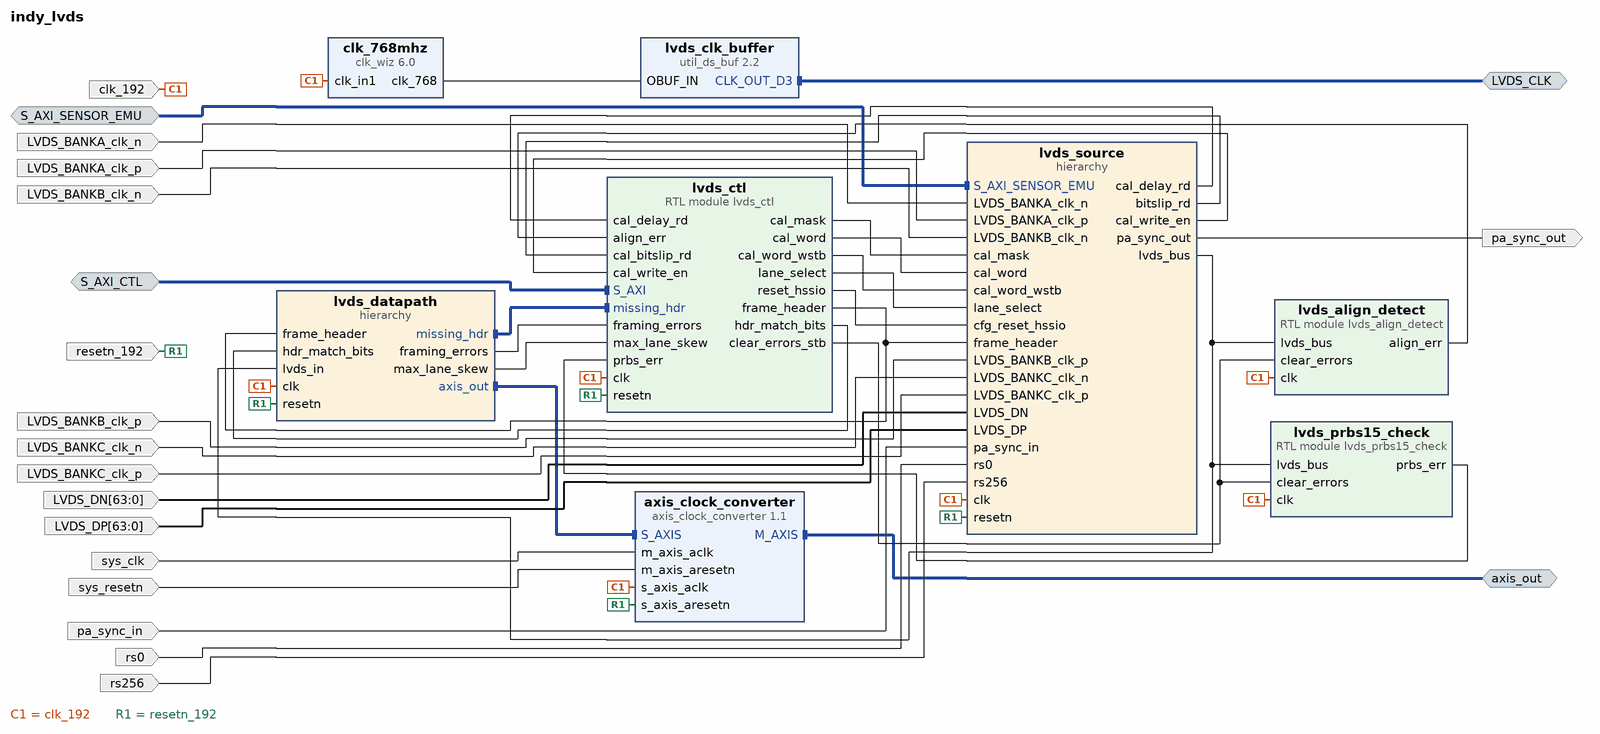
[diagram p0: block diagram of the top level]
# Vivado block design indy_lvds, xcku15p-ffve1517-3-e, Vivado 2024.2
create_bd_design indy_lvds

create_bd_intf_port -mode Slave -vlnv xilinx.com:interface:aximm_rtl:1.0 S_AXI_CTL
set_property -dict [list \
  CONFIG.ADDR_WIDTH 16 \
  CONFIG.ARUSER_WIDTH 0 \
  CONFIG.AWUSER_WIDTH 0 \
  CONFIG.BUSER_WIDTH 0 \
  CONFIG.CLK_DOMAIN top_level_clk_wiz_0_1_clk_192 \
  CONFIG.DATA_WIDTH 32 \
  CONFIG.FREQ_HZ 192000000 \
  CONFIG.HAS_BRESP 1 \
  CONFIG.HAS_BURST 0 \
  CONFIG.HAS_CACHE 0 \
  CONFIG.HAS_LOCK 0 \
  CONFIG.HAS_PROT 1 \
  CONFIG.HAS_QOS 0 \
  CONFIG.HAS_REGION 0 \
  CONFIG.HAS_RRESP 1 \
  CONFIG.HAS_WSTRB 1 \
  CONFIG.ID_WIDTH 0 \
  CONFIG.MAX_BURST_LENGTH 1 \
  CONFIG.NUM_READ_OUTSTANDING 1 \
  CONFIG.NUM_READ_THREADS 1 \
  CONFIG.NUM_WRITE_OUTSTANDING 1 \
  CONFIG.NUM_WRITE_THREADS 1 \
  CONFIG.PROTOCOL AXI4LITE \
  CONFIG.READ_WRITE_MODE READ_WRITE \
  CONFIG.RUSER_BITS_PER_BYTE 0 \
  CONFIG.RUSER_WIDTH 0 \
  CONFIG.SUPPORTS_NARROW_BURST 0 \
  CONFIG.WUSER_BITS_PER_BYTE 0 \
  CONFIG.WUSER_WIDTH 0 \
] [get_bd_intf_ports S_AXI_CTL]
create_bd_intf_port -mode Master -vlnv xilinx.com:interface:diff_clock_rtl:1.0 LVDS_CLK
create_bd_intf_port -mode Slave -vlnv xilinx.com:interface:aximm_rtl:1.0 S_AXI_SENSOR_EMU
set_property -dict [list \
  CONFIG.ADDR_WIDTH 32 \
  CONFIG.ARUSER_WIDTH 0 \
  CONFIG.AWUSER_WIDTH 0 \
  CONFIG.BUSER_WIDTH 0 \
  CONFIG.CLK_DOMAIN top_level_clk_wiz_0_1_clk_192 \
  CONFIG.DATA_WIDTH 32 \
  CONFIG.FREQ_HZ 192000000 \
  CONFIG.HAS_BRESP 1 \
  CONFIG.HAS_BURST 0 \
  CONFIG.HAS_CACHE 0 \
  CONFIG.HAS_LOCK 0 \
  CONFIG.HAS_PROT 1 \
  CONFIG.HAS_QOS 0 \
  CONFIG.HAS_REGION 0 \
  CONFIG.HAS_RRESP 1 \
  CONFIG.HAS_WSTRB 1 \
  CONFIG.ID_WIDTH 0 \
  CONFIG.NUM_READ_OUTSTANDING 1 \
  CONFIG.NUM_READ_THREADS 1 \
  CONFIG.NUM_WRITE_OUTSTANDING 1 \
  CONFIG.NUM_WRITE_THREADS 1 \
  CONFIG.PROTOCOL AXI4LITE \
  CONFIG.READ_WRITE_MODE READ_WRITE \
  CONFIG.RUSER_BITS_PER_BYTE 0 \
  CONFIG.RUSER_WIDTH 0 \
  CONFIG.WUSER_BITS_PER_BYTE 0 \
  CONFIG.WUSER_WIDTH 0 \
] [get_bd_intf_ports S_AXI_SENSOR_EMU]
create_bd_intf_port -mode Master -vlnv xilinx.com:interface:axis_rtl:1.0 axis_out
set_property -dict {CONFIG.FREQ_HZ 10000000} [get_bd_intf_ports axis_out]
create_bd_port -dir I LVDS_BANKA_clk_n
create_bd_port -dir I LVDS_BANKA_clk_p
create_bd_port -dir I LVDS_BANKB_clk_n
create_bd_port -dir I LVDS_BANKB_clk_p
create_bd_port -dir I LVDS_BANKC_clk_n
create_bd_port -dir I LVDS_BANKC_clk_p
create_bd_port -dir I -from 63 -to 0 LVDS_DN
create_bd_port -dir I -from 63 -to 0 LVDS_DP
create_bd_port -dir I -type clk clk_192
set_property -dict [list \
  CONFIG.ASSOCIATED_BUSIF S_AXI_CTL:S_AXI_SENSOR_EMU \
  CONFIG.ASSOCIATED_RESET resetn_192 \
  CONFIG.CLK_DOMAIN top_level_clk_wiz_0_1_clk_192 \
  CONFIG.FREQ_HZ 192000000 \
] [get_bd_ports clk_192]
create_bd_port -dir I -type rst resetn_192
create_bd_port -dir I rs0
create_bd_port -dir I rs256
create_bd_port -dir I pa_sync_in
create_bd_port -dir O pa_sync_out
create_bd_port -dir I -type rst sys_resetn
create_bd_port -dir I -type clk sys_clk
set_property -dict {CONFIG.ASSOCIATED_BUSIF axis_out CONFIG.FREQ_HZ 10000000} [get_bd_ports sys_clk]

create_bd_cell -type module -reference lvds_ctl lvds_ctl
create_bd_cell -type hier lvds_source
create_bd_cell -type ip -vlnv xilinx.com:ip:clk_wiz:6.0 clk_768mhz
set_property -dict [list \
  CONFIG.CLKOUT1_DRIVES No_buffer \
  CONFIG.CLKOUT1_JITTER 64.075 \
  CONFIG.CLKOUT1_PHASE_ERROR 72.940 \
  CONFIG.CLKOUT1_REQUESTED_OUT_FREQ 768 \
  CONFIG.CLK_OUT1_PORT clk_768 \
  CONFIG.FEEDBACK_SOURCE FDBK_ONCHIP \
  CONFIG.MMCM_CLKFBOUT_MULT_F 8.000 \
  CONFIG.MMCM_CLKOUT0_DIVIDE_F 2.000 \
  CONFIG.PRIM_SOURCE Global_buffer \
  CONFIG.USE_LOCKED false \
  CONFIG.USE_RESET false \
] [get_bd_cells clk_768mhz]
create_bd_cell -type ip -vlnv xilinx.com:ip:util_ds_buf:2.2 lvds_clk_buffer
set_property -dict {CONFIG.C_BUF_TYPE OBUFDS} [get_bd_cells lvds_clk_buffer]
create_bd_cell -type module -reference lvds_align_detect lvds_align_detect
create_bd_cell -type module -reference lvds_prbs15_check lvds_prbs15_check
create_bd_cell -type hier lvds_datapath
create_bd_cell -type ip -vlnv xilinx.com:ip:axis_clock_converter:1.1 axis_clock_converter

# ---- hierarchy /lvds_source ----
current_bd_instance /lvds_source
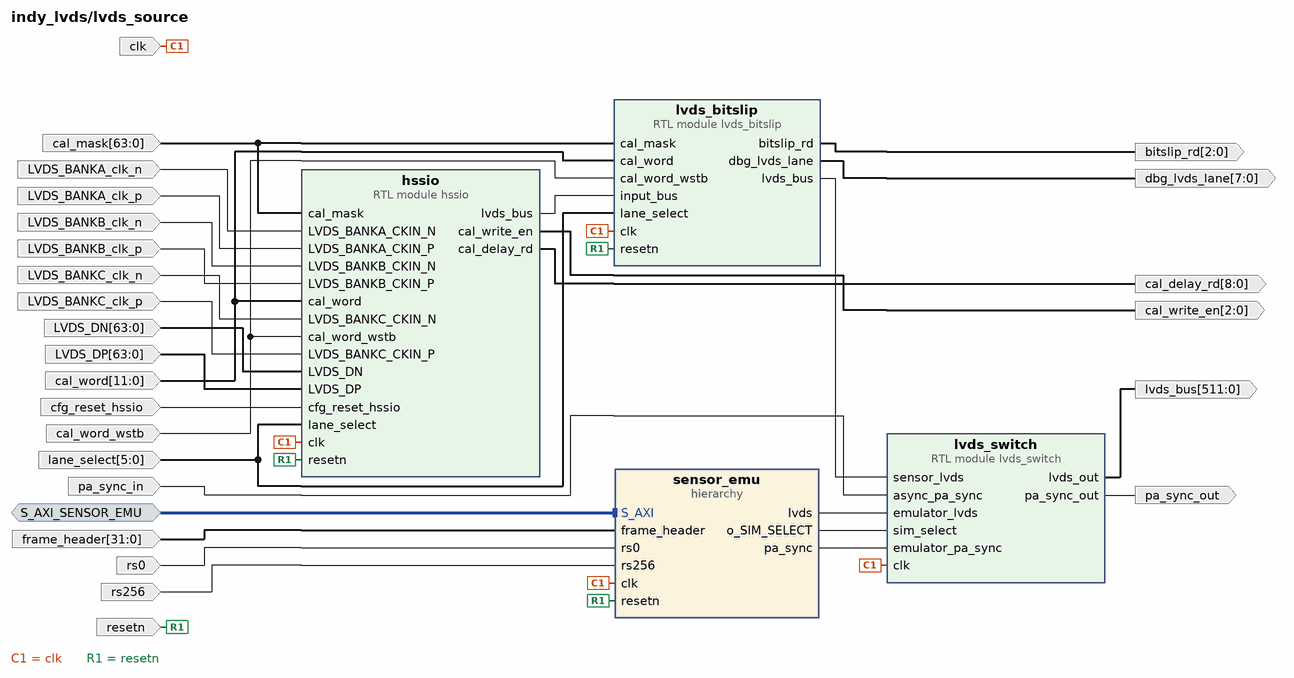
[diagram p1: block diagram inside /lvds_source]
create_bd_intf_pin -mode Slave -vlnv xilinx.com:interface:aximm_rtl:1.0 S_AXI_SENSOR_EMU
create_bd_pin -dir I -type clk clk
create_bd_pin -dir I -type rst resetn
create_bd_pin -dir I -from 5 -to 0 lane_select
create_bd_pin -dir I cal_word_wstb
create_bd_pin -dir I -from 11 -to 0 cal_word
create_bd_pin -dir I LVDS_BANKA_clk_p
create_bd_pin -dir I LVDS_BANKA_clk_n
create_bd_pin -dir I LVDS_BANKB_clk_p
create_bd_pin -dir I LVDS_BANKB_clk_n
create_bd_pin -dir I LVDS_BANKC_clk_p
create_bd_pin -dir I LVDS_BANKC_clk_n
create_bd_pin -dir I -from 63 -to 0 LVDS_DN
create_bd_pin -dir I -from 63 -to 0 LVDS_DP
create_bd_pin -dir I cfg_reset_hssio
create_bd_pin -dir O -from 8 -to 0 cal_delay_rd
create_bd_pin -dir O -from 2 -to 0 cal_write_en
create_bd_pin -dir I -from 63 -to 0 cal_mask
create_bd_pin -dir O -from 2 -to 0 bitslip_rd
create_bd_pin -dir O -from 511 -to 0 lvds_bus
create_bd_pin -dir O -from 7 -to 0 dbg_lvds_lane
create_bd_pin -dir I rs0
create_bd_pin -dir I rs256
create_bd_pin -dir I -from 31 -to 0 frame_header
create_bd_pin -dir I pa_sync_in
create_bd_pin -dir O pa_sync_out

create_bd_cell -type module -reference hssio hssio
create_bd_cell -type module -reference lvds_bitslip lvds_bitslip
create_bd_cell -type hier sensor_emu
create_bd_cell -type module -reference lvds_switch lvds_switch

# ---- hierarchy /lvds_source/sensor_emu ----
current_bd_instance /lvds_source/sensor_emu
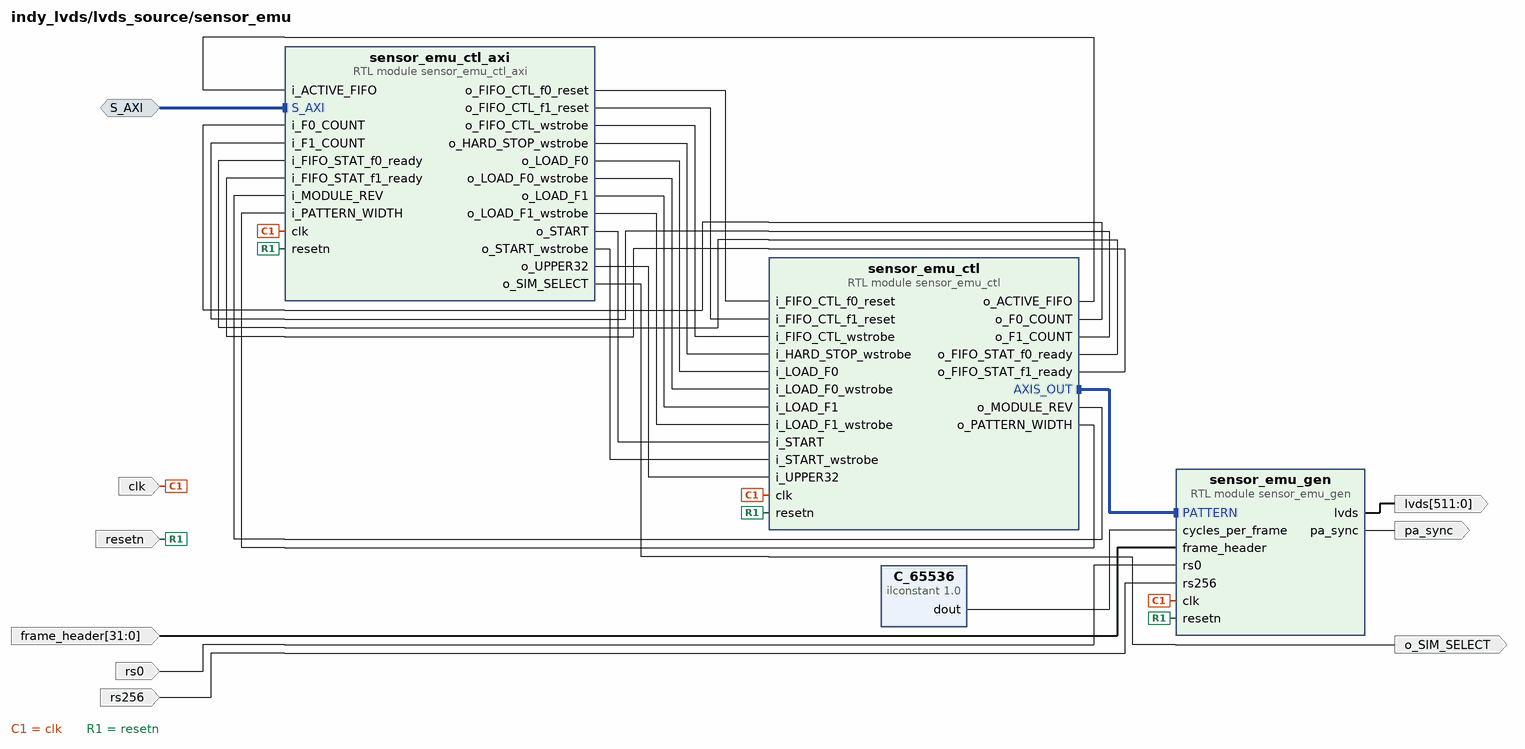
[diagram p2: block diagram inside /lvds_source/sensor_emu]
create_bd_intf_pin -mode Slave -vlnv xilinx.com:interface:aximm_rtl:1.0 S_AXI
create_bd_pin -dir I clk
create_bd_pin -dir I resetn
create_bd_pin -dir I rs0
create_bd_pin -dir I rs256
create_bd_pin -dir O -from 511 -to 0 lvds
create_bd_pin -dir O pa_sync
create_bd_pin -dir I -from 31 -to 0 frame_header
create_bd_pin -dir O o_SIM_SELECT

create_bd_cell -type module -reference sensor_emu_ctl sensor_emu_ctl
create_bd_cell -type module -reference sensor_emu_gen sensor_emu_gen
create_bd_cell -type module -reference sensor_emu_ctl_axi sensor_emu_ctl_axi
create_bd_cell -type inline_hdl -vlnv xilinx.com:inline_hdl:ilconstant:1.0 C_65536
set_property -dict {CONFIG.CONST_VAL 65536 CONFIG.CONST_WIDTH 32} [get_bd_cells C_65536]

# ---- hierarchy /lvds_datapath ----
current_bd_instance /lvds_datapath
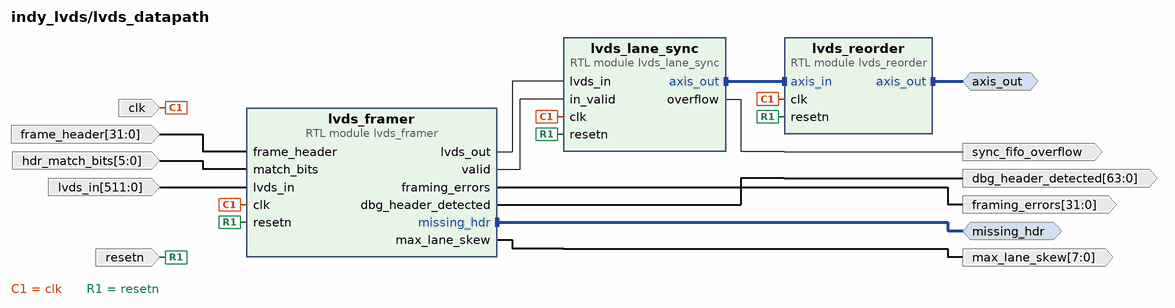
[diagram p3: block diagram inside /lvds_datapath]
create_bd_intf_pin -mode Master -vlnv xilinx.com:interface:axis_rtl:1.0 missing_hdr
create_bd_intf_pin -mode Master -vlnv xilinx.com:interface:axis_rtl:1.0 axis_out
create_bd_pin -dir I -type clk clk
create_bd_pin -dir I -type rst resetn
create_bd_pin -dir I -from 31 -to 0 frame_header
create_bd_pin -dir I -from 5 -to 0 hdr_match_bits
create_bd_pin -dir I -from 511 -to 0 lvds_in
create_bd_pin -dir O -from 31 -to 0 framing_errors
create_bd_pin -dir O -from 7 -to 0 max_lane_skew
create_bd_pin -dir O sync_fifo_overflow
create_bd_pin -dir O -from 63 -to 0 dbg_header_detected

create_bd_cell -type module -reference lvds_framer lvds_framer
create_bd_cell -type module -reference lvds_lane_sync lvds_lane_sync
create_bd_cell -type module -reference lvds_reorder lvds_reorder

# ---- connections ----

current_bd_instance /lvds_source
connect_bd_intf_net [get_bd_intf_pins S_AXI_SENSOR_EMU] [get_bd_intf_pins sensor_emu/S_AXI]
connect_bd_net [get_bd_pins LVDS_BANKA_clk_n] [get_bd_pins hssio/LVDS_BANKA_CKIN_N]
connect_bd_net [get_bd_pins LVDS_BANKA_clk_p] [get_bd_pins hssio/LVDS_BANKA_CKIN_P]
connect_bd_net [get_bd_pins LVDS_BANKB_clk_n] [get_bd_pins hssio/LVDS_BANKB_CKIN_N]
connect_bd_net [get_bd_pins LVDS_BANKB_clk_p] [get_bd_pins hssio/LVDS_BANKB_CKIN_P]
connect_bd_net [get_bd_pins LVDS_BANKC_clk_n] [get_bd_pins hssio/LVDS_BANKC_CKIN_N]
connect_bd_net [get_bd_pins LVDS_BANKC_clk_p] [get_bd_pins hssio/LVDS_BANKC_CKIN_P]
connect_bd_net [get_bd_pins LVDS_DN] [get_bd_pins hssio/LVDS_DN]
connect_bd_net [get_bd_pins LVDS_DP] [get_bd_pins hssio/LVDS_DP]
connect_bd_net [get_bd_pins cal_mask] [get_bd_pins hssio/cal_mask] [get_bd_pins lvds_bitslip/cal_mask]
connect_bd_net [get_bd_pins cal_word] [get_bd_pins hssio/cal_word] [get_bd_pins lvds_bitslip/cal_word]
connect_bd_net [get_bd_pins cal_word_wstb] [get_bd_pins hssio/cal_word_wstb] [get_bd_pins lvds_bitslip/cal_word_wstb]
connect_bd_net [get_bd_pins cfg_reset_hssio] [get_bd_pins hssio/cfg_reset_hssio]
connect_bd_net -net clk_192mhz_clk_192 [get_bd_pins clk] \
  [get_bd_pins hssio/clk] [get_bd_pins lvds_bitslip/clk] [get_bd_pins sensor_emu/clk] [get_bd_pins lvds_switch/clk]
connect_bd_net [get_bd_pins frame_header] [get_bd_pins sensor_emu/frame_header]
connect_bd_net [get_bd_pins hssio/cal_write_en] [get_bd_pins cal_write_en]
connect_bd_net -net hssio_delay_rd [get_bd_pins hssio/cal_delay_rd] [get_bd_pins cal_delay_rd]
connect_bd_net [get_bd_pins hssio/lvds_bus] [get_bd_pins lvds_bitslip/input_bus]
connect_bd_net [get_bd_pins lane_select] [get_bd_pins hssio/lane_select] [get_bd_pins lvds_bitslip/lane_select]
connect_bd_net [get_bd_pins lvds_bitslip/bitslip_rd] [get_bd_pins bitslip_rd]
connect_bd_net [get_bd_pins lvds_bitslip/dbg_lvds_lane] [get_bd_pins dbg_lvds_lane]
connect_bd_net [get_bd_pins lvds_bitslip/lvds_bus] [get_bd_pins lvds_switch/sensor_lvds]
connect_bd_net -net lvds_switch_0_lvds_out [get_bd_pins lvds_switch/lvds_out] [get_bd_pins lvds_bus]
connect_bd_net -net lvds_switch_0_pa_sync_out [get_bd_pins lvds_switch/pa_sync_out] [get_bd_pins pa_sync_out]
connect_bd_net [get_bd_pins pa_sync_in] [get_bd_pins lvds_switch/async_pa_sync]
connect_bd_net -net rs0_1 [get_bd_pins rs0] [get_bd_pins sensor_emu/rs0]
connect_bd_net -net rs256_1 [get_bd_pins rs256] [get_bd_pins sensor_emu/rs256]
connect_bd_net [get_bd_pins sensor_emu/lvds] [get_bd_pins lvds_switch/emulator_lvds]
connect_bd_net [get_bd_pins sensor_emu/o_SIM_SELECT] [get_bd_pins lvds_switch/sim_select]
connect_bd_net [get_bd_pins sensor_emu/pa_sync] [get_bd_pins lvds_switch/emulator_pa_sync]
connect_bd_net -net sys_192mhz_resetn_192 [get_bd_pins resetn] \
  [get_bd_pins hssio/resetn] [get_bd_pins lvds_bitslip/resetn] [get_bd_pins sensor_emu/resetn]

current_bd_instance /lvds_source/sensor_emu
connect_bd_intf_net [get_bd_intf_pins S_AXI] [get_bd_intf_pins sensor_emu_ctl_axi/S_AXI]
connect_bd_intf_net -intf_net sensor_emu_ctl_0_AXIS_OUT [get_bd_intf_pins sensor_emu_ctl/AXIS_OUT] [get_bd_intf_pins sensor_emu_gen/PATTERN]
connect_bd_net [get_bd_pins clk] [get_bd_pins sensor_emu_ctl/clk] [get_bd_pins sensor_emu_gen/clk] [get_bd_pins sensor_emu_ctl_axi/clk]
connect_bd_net [get_bd_pins frame_header] [get_bd_pins sensor_emu_gen/frame_header]
connect_bd_net -net ilconstant_0_dout [get_bd_pins C_65536/dout] [get_bd_pins sensor_emu_gen/cycles_per_frame]
connect_bd_net [get_bd_pins resetn] [get_bd_pins sensor_emu_ctl/resetn] [get_bd_pins sensor_emu_gen/resetn] [get_bd_pins sensor_emu_ctl_axi/resetn]
connect_bd_net -net rs0_1 [get_bd_pins rs0] [get_bd_pins sensor_emu_gen/rs0]
connect_bd_net -net rs256_1 [get_bd_pins rs256] [get_bd_pins sensor_emu_gen/rs256]
connect_bd_net -net sensor_emu_ctl_0_o_ACTIVE_FIFO [get_bd_pins sensor_emu_ctl/o_ACTIVE_FIFO] [get_bd_pins sensor_emu_ctl_axi/i_ACTIVE_FIFO]
connect_bd_net -net sensor_emu_ctl_0_o_F0_COUNT [get_bd_pins sensor_emu_ctl/o_F0_COUNT] [get_bd_pins sensor_emu_ctl_axi/i_F0_COUNT]
connect_bd_net -net sensor_emu_ctl_0_o_F1_COUNT [get_bd_pins sensor_emu_ctl/o_F1_COUNT] [get_bd_pins sensor_emu_ctl_axi/i_F1_COUNT]
connect_bd_net -net sensor_emu_ctl_0_o_FIFO_STAT_f0_ready [get_bd_pins sensor_emu_ctl/o_FIFO_STAT_f0_ready] \
  [get_bd_pins sensor_emu_ctl_axi/i_FIFO_STAT_f0_ready]
connect_bd_net -net sensor_emu_ctl_0_o_FIFO_STAT_f1_ready [get_bd_pins sensor_emu_ctl/o_FIFO_STAT_f1_ready] \
  [get_bd_pins sensor_emu_ctl_axi/i_FIFO_STAT_f1_ready]
connect_bd_net -net sensor_emu_ctl_0_o_MODULE_REV [get_bd_pins sensor_emu_ctl/o_MODULE_REV] [get_bd_pins sensor_emu_ctl_axi/i_MODULE_REV]
connect_bd_net -net sensor_emu_ctl_0_o_PATTERN_WIDTH [get_bd_pins sensor_emu_ctl/o_PATTERN_WIDTH] [get_bd_pins sensor_emu_ctl_axi/i_PATTERN_WIDTH]
connect_bd_net -net sensor_emu_ctl_axi_0_o_FIFO_CTL_f0_reset [get_bd_pins sensor_emu_ctl_axi/o_FIFO_CTL_f0_reset] \
  [get_bd_pins sensor_emu_ctl/i_FIFO_CTL_f0_reset]
connect_bd_net -net sensor_emu_ctl_axi_0_o_FIFO_CTL_f1_reset [get_bd_pins sensor_emu_ctl_axi/o_FIFO_CTL_f1_reset] \
  [get_bd_pins sensor_emu_ctl/i_FIFO_CTL_f1_reset]
connect_bd_net -net sensor_emu_ctl_axi_0_o_FIFO_CTL_wstrobe [get_bd_pins sensor_emu_ctl_axi/o_FIFO_CTL_wstrobe] \
  [get_bd_pins sensor_emu_ctl/i_FIFO_CTL_wstrobe]
connect_bd_net -net sensor_emu_ctl_axi_0_o_HARD_STOP_wstrobe [get_bd_pins sensor_emu_ctl_axi/o_HARD_STOP_wstrobe] \
  [get_bd_pins sensor_emu_ctl/i_HARD_STOP_wstrobe]
connect_bd_net -net sensor_emu_ctl_axi_0_o_LOAD_F0 [get_bd_pins sensor_emu_ctl_axi/o_LOAD_F0] [get_bd_pins sensor_emu_ctl/i_LOAD_F0]
connect_bd_net -net sensor_emu_ctl_axi_0_o_LOAD_F0_wstrobe [get_bd_pins sensor_emu_ctl_axi/o_LOAD_F0_wstrobe] \
  [get_bd_pins sensor_emu_ctl/i_LOAD_F0_wstrobe]
connect_bd_net -net sensor_emu_ctl_axi_0_o_LOAD_F1 [get_bd_pins sensor_emu_ctl_axi/o_LOAD_F1] [get_bd_pins sensor_emu_ctl/i_LOAD_F1]
connect_bd_net -net sensor_emu_ctl_axi_0_o_LOAD_F1_wstrobe [get_bd_pins sensor_emu_ctl_axi/o_LOAD_F1_wstrobe] \
  [get_bd_pins sensor_emu_ctl/i_LOAD_F1_wstrobe]
connect_bd_net -net sensor_emu_ctl_axi_0_o_SIM_SELECT [get_bd_pins sensor_emu_ctl_axi/o_SIM_SELECT] [get_bd_pins o_SIM_SELECT]
connect_bd_net -net sensor_emu_ctl_axi_0_o_START [get_bd_pins sensor_emu_ctl_axi/o_START] [get_bd_pins sensor_emu_ctl/i_START]
connect_bd_net -net sensor_emu_ctl_axi_0_o_START_wstrobe [get_bd_pins sensor_emu_ctl_axi/o_START_wstrobe] [get_bd_pins sensor_emu_ctl/i_START_wstrobe]
connect_bd_net -net sensor_emu_ctl_axi_0_o_UPPER32 [get_bd_pins sensor_emu_ctl_axi/o_UPPER32] [get_bd_pins sensor_emu_ctl/i_UPPER32]
connect_bd_net -net sensor_emu_gen_0_lvds [get_bd_pins sensor_emu_gen/lvds] [get_bd_pins lvds]
connect_bd_net -net sensor_emu_gen_0_pa_sync [get_bd_pins sensor_emu_gen/pa_sync] [get_bd_pins pa_sync]

current_bd_instance /lvds_datapath
connect_bd_intf_net [get_bd_intf_pins missing_hdr] [get_bd_intf_pins lvds_framer/missing_hdr]
connect_bd_intf_net [get_bd_intf_pins lvds_reorder/axis_in] [get_bd_intf_pins lvds_lane_sync/axis_out]
connect_bd_intf_net [get_bd_intf_pins axis_out] [get_bd_intf_pins lvds_reorder/axis_out]
connect_bd_net -net clk_192mhz_clk_192 [get_bd_pins clk] [get_bd_pins lvds_lane_sync/clk] [get_bd_pins lvds_framer/clk] [get_bd_pins lvds_reorder/clk]
connect_bd_net [get_bd_pins frame_header] [get_bd_pins lvds_framer/frame_header]
connect_bd_net [get_bd_pins hdr_match_bits] [get_bd_pins lvds_framer/match_bits]
connect_bd_net -net lvds_bitslip_lvds_bus [get_bd_pins lvds_in] [get_bd_pins lvds_framer/lvds_in]
connect_bd_net -net lvds_framer_0_framing_errors [get_bd_pins lvds_framer/framing_errors] [get_bd_pins framing_errors]
connect_bd_net [get_bd_pins lvds_framer/dbg_header_detected] [get_bd_pins dbg_header_detected]
connect_bd_net [get_bd_pins lvds_framer/lvds_out] [get_bd_pins lvds_lane_sync/lvds_in]
connect_bd_net [get_bd_pins lvds_framer/max_lane_skew] [get_bd_pins max_lane_skew]
connect_bd_net [get_bd_pins lvds_framer/valid] [get_bd_pins lvds_lane_sync/in_valid]
connect_bd_net -net lvds_lane_sync_0_overflow [get_bd_pins lvds_lane_sync/overflow] [get_bd_pins sync_fifo_overflow]
connect_bd_net -net sys_192mhz_resetn_192 [get_bd_pins resetn] \
  [get_bd_pins lvds_lane_sync/resetn] [get_bd_pins lvds_framer/resetn] [get_bd_pins lvds_reorder/resetn]

current_bd_instance /
connect_bd_intf_net [get_bd_intf_ports S_AXI_CTL] [get_bd_intf_pins lvds_ctl/S_AXI]
connect_bd_intf_net [get_bd_intf_pins lvds_source/S_AXI_SENSOR_EMU] [get_bd_intf_ports S_AXI_SENSOR_EMU]
connect_bd_intf_net [get_bd_intf_pins axis_clock_converter/M_AXIS] [get_bd_intf_ports axis_out]
connect_bd_intf_net [get_bd_intf_pins lvds_clk_buffer/CLK_OUT_D3] [get_bd_intf_ports LVDS_CLK]
connect_bd_intf_net [get_bd_intf_pins lvds_datapath/axis_out] [get_bd_intf_pins axis_clock_converter/S_AXIS]
connect_bd_intf_net [get_bd_intf_pins lvds_datapath/missing_hdr] [get_bd_intf_pins lvds_ctl/missing_hdr]
connect_bd_net [get_bd_ports LVDS_BANKA_clk_n] [get_bd_pins lvds_source/LVDS_BANKA_clk_n]
connect_bd_net [get_bd_ports LVDS_BANKA_clk_p] [get_bd_pins lvds_source/LVDS_BANKA_clk_p]
connect_bd_net [get_bd_ports LVDS_BANKB_clk_n] [get_bd_pins lvds_source/LVDS_BANKB_clk_n]
connect_bd_net [get_bd_ports LVDS_BANKB_clk_p] [get_bd_pins lvds_source/LVDS_BANKB_clk_p]
connect_bd_net [get_bd_ports LVDS_BANKC_clk_n] [get_bd_pins lvds_source/LVDS_BANKC_clk_n]
connect_bd_net [get_bd_ports LVDS_BANKC_clk_p] [get_bd_pins lvds_source/LVDS_BANKC_clk_p]
connect_bd_net [get_bd_ports LVDS_DN] [get_bd_pins lvds_source/LVDS_DN]
connect_bd_net [get_bd_ports LVDS_DP] [get_bd_pins lvds_source/LVDS_DP]
connect_bd_net -net clk_192mhz_clk_192 [get_bd_ports clk_192] \
  [get_bd_pins lvds_source/clk] [get_bd_pins clk_768mhz/clk_in1] [get_bd_pins lvds_align_detect/clk] \
  [get_bd_pins lvds_prbs15_check/clk] [get_bd_pins lvds_datapath/clk] [get_bd_pins axis_clock_converter/s_axis_aclk] \
  [get_bd_pins lvds_ctl/clk]
connect_bd_net [get_bd_pins clk_768mhz/clk_768] [get_bd_pins lvds_clk_buffer/OBUF_IN]
connect_bd_net -net hier_0_delay_rd [get_bd_pins lvds_source/cal_delay_rd] [get_bd_pins lvds_ctl/cal_delay_rd]
connect_bd_net [get_bd_pins lvds_align_detect/align_err] [get_bd_pins lvds_ctl/align_err]
connect_bd_net -net lvds_bitslip_lvds_bus [get_bd_pins lvds_source/lvds_bus] \
  [get_bd_pins lvds_align_detect/lvds_bus] [get_bd_pins lvds_prbs15_check/lvds_bus] [get_bd_pins lvds_datapath/lvds_in]
connect_bd_net [get_bd_pins lvds_ctl/cal_mask] [get_bd_pins lvds_source/cal_mask]
connect_bd_net [get_bd_pins lvds_ctl/cal_word] [get_bd_pins lvds_source/cal_word]
connect_bd_net [get_bd_pins lvds_ctl/cal_word_wstb] [get_bd_pins lvds_source/cal_word_wstb]
connect_bd_net [get_bd_pins lvds_ctl/clear_errors_stb] [get_bd_pins lvds_align_detect/clear_errors] [get_bd_pins lvds_prbs15_check/clear_errors]
connect_bd_net [get_bd_pins lvds_ctl/frame_header] [get_bd_pins lvds_datapath/frame_header] [get_bd_pins lvds_source/frame_header]
connect_bd_net [get_bd_pins lvds_ctl/hdr_match_bits] [get_bd_pins lvds_datapath/hdr_match_bits]
connect_bd_net [get_bd_pins lvds_ctl/lane_select] [get_bd_pins lvds_source/lane_select]
connect_bd_net [get_bd_pins lvds_ctl/reset_hssio] [get_bd_pins lvds_source/cfg_reset_hssio]
connect_bd_net -net lvds_datapath_bitslip_rd [get_bd_pins lvds_source/bitslip_rd] [get_bd_pins lvds_ctl/cal_bitslip_rd]
connect_bd_net -net lvds_datapath_cal_write_en [get_bd_pins lvds_source/cal_write_en] [get_bd_pins lvds_ctl/cal_write_en]
connect_bd_net -net lvds_frame_and_reorder_framing_errors [get_bd_pins lvds_datapath/framing_errors] [get_bd_pins lvds_ctl/framing_errors]
connect_bd_net -net lvds_frame_and_reorder_max_lane_skew [get_bd_pins lvds_datapath/max_lane_skew] [get_bd_pins lvds_ctl/max_lane_skew]
connect_bd_net [get_bd_pins lvds_prbs15_check/prbs_err] [get_bd_pins lvds_ctl/prbs_err]
connect_bd_net [get_bd_pins lvds_source/pa_sync_out] [get_bd_ports pa_sync_out]
connect_bd_net [get_bd_ports pa_sync_in] [get_bd_pins lvds_source/pa_sync_in]
connect_bd_net -net rs0_1 [get_bd_ports rs0] [get_bd_pins lvds_source/rs0]
connect_bd_net -net rs256_1 [get_bd_ports rs256] [get_bd_pins lvds_source/rs256]
connect_bd_net -net sys_192mhz_resetn_192 [get_bd_ports resetn_192] \
  [get_bd_pins lvds_source/resetn] [get_bd_pins lvds_datapath/resetn] [get_bd_pins axis_clock_converter/s_axis_aresetn] \
  [get_bd_pins lvds_ctl/resetn]
connect_bd_net [get_bd_ports sys_clk] [get_bd_pins axis_clock_converter/m_axis_aclk]
connect_bd_net [get_bd_ports sys_resetn] [get_bd_pins axis_clock_converter/m_axis_aresetn]

# ---- address map ----
assign_bd_address -offset 0x2000 -range 4K -target_address_space [get_bd_addr_spaces S_AXI_CTL] [get_bd_addr_segs lvds_ctl/S_AXI/reg0]
assign_bd_address -offset 0x00000000 -range 4K -target_address_space [get_bd_addr_spaces S_AXI_SENSOR_EMU] [get_bd_addr_segs lvds_source/sensor_emu/sensor_emu_ctl_axi/S_AXI/reg0]

validate_bd_design
save_bd_design
